# Altium project PE.PrjPcb
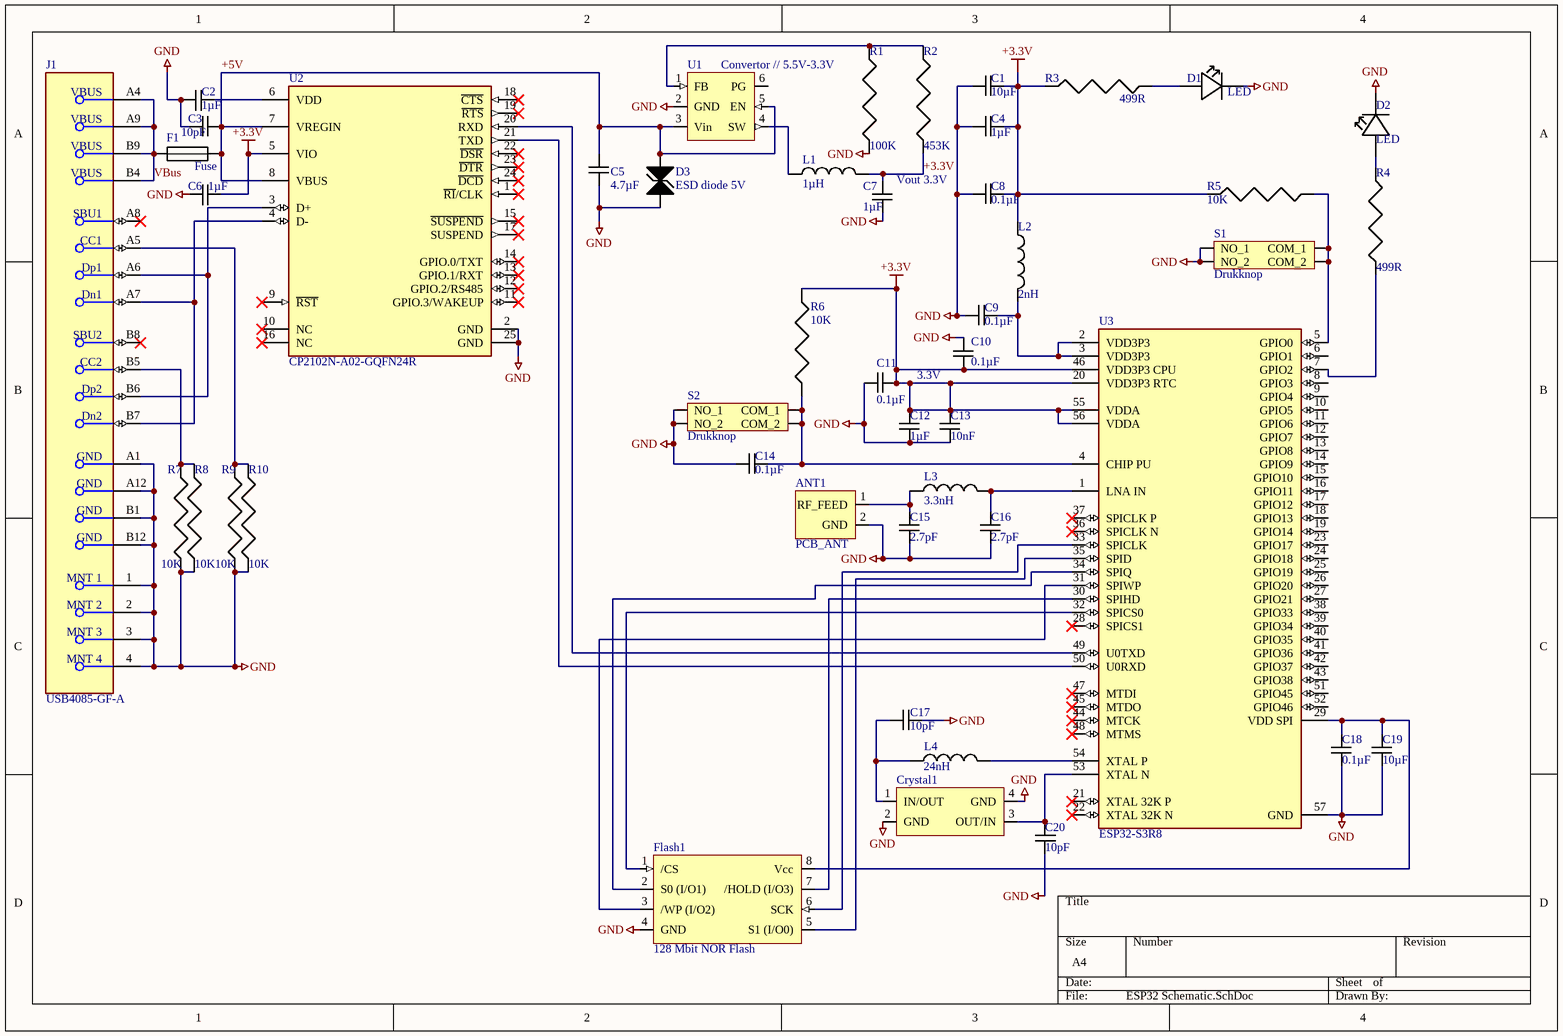
[diagram p0: ESP32 Schematic.SchDoc]
1 sheet, 47 parts. Net scope: global (net labels, ports and power ports of the same name join across sheets).
Board files: PCB-v1.PcbDoc, PCB-v2.PcbDoc, PCB-v3.PcbDoc

## Sheet ESP32 Schematic.SchDoc
size A4; SheetNumber: 1; SheetTotal: 1

### Parts
ANT1  PCB_ANT  [Antenne // RFANT5220110A0T]
C1  10µF  [CAP_General_0603]
C2  1µF  [CAP_General_0603]
C3  10pF  [CAP_General_0603]
C4  1µF  [CAP_General_0603]
C5  4.7µF  [CAP_General_0603]
C6  1µF  [CAP_General_0603]
C7  1µF  [CAP_General_0603]
C8  0.1µF  [CAP_General_0603]
C9  0.1µF  [CAP_General_0603]
C10  0.1µF  [CAP_General_0603]
C11  0.1µF  [CAP_General_0603]
C12  1µF  [CAP_General_0603]
C13  10nF  [CAP_General_0603]
C14  0.1µF  [CAP_General_0603]
C15  2.7pF  [CAP_General_0603]
C16  2.7pF  [CAP_General_0603]
C17  10pF  [CAP_General_0603]
C18  0.1µF  [CAP_General_0603]
C19  10µF  [CAP_General_0603]
C20  10pF  [CAP_General_0603]
Crystal1  Crystal  [Crystal // ECS­400­8­47B2­CKM­TR]  (value not drawn)
D1  LED  [LED // KRDELPS1.22-UIVG-46-H3Q4-XX]
D2  LED  [LED // KRDELPS1.22-UIVG-46-H3Q4-XX]
D3  ESD diode 5V  [ESD diode 5V // SMF5.0A]
F1  Fuse  [Fuse // 0603L050SLYR]
Flash1  128 Mbit NOR Flash  [128 Mbit NOR Flash // AT25QF128A-MHB-T]
J1  USB4085-GF-A  [USB-C connector // USB4085-GF-A]
L1  1µH  [Inductor 1µH // MLP2520H1R0MT0S1]
L2  2nH  [Inductor 2nH // MLG1005S2N0BTD25]
L3  3.3nH  [Inductor 3.3nH // AIMC-0805-3N3]
L4  24nH  [Inductor 24 nH // 36501J24NJTDG]
R1  100K  [RES_100K_0603]
R2  453K  [RES_453K_0603]
R3  499R  [RES_499R_0603]
R4  499R  [RES_499R_0603]
R5  10K  [RES_10K_0603_1]
R6  10K  [RES_10K_0603_1]
R7  10K  [RES_10K_0603_1]
R8  10K  [RES_10K_0603_1]
R9  10K  [RES_10K_0603_1]
R10  10K  [RES_10K_0603_1]
S1  Drukknop  [Tactile Switches // FSM4JSMAATR]
S2  Drukknop  [Tactile Switches // FSM4JSMAATR]
U1  Convertor // 5.5V-3.3V  [CONVERTOR // TLV62569APDRLR]
U2  CP2102N-A02-GQFN24R  [USB Bridge // CP2102N-A02-GQFN24R]
U3  ESP32-S3R8  [FP-ESP32-S3R8]

### Nets
+3.3V: C1.2 C4.2 C6.1 C7.2 C8.2 C10.1 C11.2 C12.2 C13.2 L1.2 L2.1 R2.2 R3.1 R5.1 R6.2 U2.5(VIO) U3.20(VDD3P3_RTC) U3.46(VDD3P3_CPU) U3.55(VDDA) U3.56(VDDA)
GND: ANT1.2(GND) C1.1 C2.2 C3.1 C4.1 C5.1 C6.2 C7.1 C8.1 C9.1 C10.2 C11.1 C12.1 C13.1 C14.1 C15.1 C16.1 C17.2 C18.1 C19.1 C20.2 Crystal1.2(GND) Crystal1.4(GND) D1.2 D2.2 D3.2 Flash1.4(GND) J1.1(MNT_1) J1.2(MNT_2) J1.3(MNT_3) J1.4(MNT_4) J1.A1(GND) J1.A12(GND) J1.B1(GND) J1.B12(GND) R1.1 R7.1 R8.1 R9.1 R10.1 S1.3(NO_1) S1.4(NO_2) S2.3(NO_1) S2.4(NO_2) U1.2(GND) U2.2(GND) U2.25(GND) U3.57(GND)
+5V: C3.2 C5.2 D3.1 F1.2 U1.3(Vin) U1.5(EN) U2.7(VREGIN) U2.8(VBUS)
VBus: F1.1 J1.A4(VBUS) J1.A9(VBUS) J1.B4(VBUS) J1.B9(VBUS)
NetANT1_1: ANT1.1(RF_FEED) C15.2 L3.1
NetC2_1: C2.1 U2.6(VDD)
NetC9_2: C9.2 L2.2 U3.2(VDD3P3) U3.3(VDD3P3)
NetC14_2: C14.2 R6.1 S2.1(COM_1) S2.2(COM_2) U3.4(CHIP_PU)
NetC16_2: C16.2 L3.2 U3.1(LNA_IN)
NetC17_1: C17.1 Crystal1.1(IN/OUT) L4.1
NetC18_2: C18.2 C19.2 Flash1.8(Vcc) U3.29(VDD_SPI)
NetC20_1: C20.1 Crystal1.3(OUT/IN) U3.53(XTAL_N)
NetD1_1: D1.1 R3.2
NetD2_1: D2.1 R4.2
NetFlash1_1: Flash1.1(/CS) U3.32(SPICS0)
NetFlash1_2: Flash1.2(S0_(I/O1)) U3.34(SPIQ)
NetFlash1_3: Flash1.3(/WP_(I/O2)) U3.31(SPIWP)
NetFlash1_5: Flash1.5(S1_(I/O0)) U3.35(SPID)
NetFlash1_6: Flash1.6(SCK) U3.33(SPICLK)
NetFlash1_7: Flash1.7(/HOLD_(I/O3)) U3.30(SPIHD)
NetJ1_A5: J1.A5(CC1) R9.2 R10.2
NetJ1_A6: J1.A6(Dp1) J1.B6(Dp2) U2.3(D+)
NetJ1_A7: J1.A7(Dn1) J1.B7(Dn2) U2.4(D-)
NetJ1_B5: J1.B5(CC2) R7.2 R8.2
NetL1_1: L1.1 U1.4(SW)
NetL4_2: L4.2 U3.54(XTAL_P)
NetR1_2: R1.2 R2.1 U1.1(FB)
NetR4_1: R4.1 U3.7(GPIO2)
NetR5_2: R5.2 S1.1(COM_1) S1.2(COM_2) U3.5(GPIO0)
NetU2_20: U2.20(RXD) U3.49(U0TXD)
NetU2_21: U2.21(TXD) U3.50(U0RXD)

Not connected (* = marked no-connect by the designer): J1 A8(SBU1)* B8(SBU2)*; U1 6(PG); U2 1(~{RI}/CLK)* 9(~{RST})* 10(NC)* 11(GPIO.3/WAKEUP)* 12(GPIO.2/RS485)* 13(GPIO.1/RXT)* 14(GPIO.0/TXT)* 15(~{SUSPEND})* 16(NC)* 17(SUSPEND)* 18(~{CTS})* 19(~{RTS})* 22(~{DSR})* 23(~{DTR})* 24(~{DCD})*; U3 6(GPIO1) 8(GPIO3) 9(GPIO4) 10(GPIO5) 11(GPIO6) 12(GPIO7) 13(GPIO8) 14(GPIO9) 15(GPIO10) 16(GPIO11) 17(GPIO12) 18(GPIO13) 19(GPIO14) 21(XTAL_32K_P)* 22(XTAL_32K_N)* 23(GPIO17) 24(GPIO18) 25(GPIO19) 26(GPIO20) 27(GPIO21) 28(SPICS1)* 36(SPICLK_N)* 37(SPICLK_P)* 38(GPIO33) 39(GPIO34) 40(GPIO35) 41(GPIO36) 42(GPIO37) 43(GPIO38) 44(MTCK)* 45(MTDO)* 47(MTDI)* 48(MTMS)* 51(GPIO45) 52(GPIO46)

### Notes on the sheet
- (near C7) Vout 3.3V
- 3.3V

### Library data of the parts
ANT1 = Antenne // RFANT5220110A0T
C1-C20 = CAP_General_0603: Capacitor SMD 0603 ?pF
Crystal1 = Crystal // ECS­400­8­47B2­CKM­TR
D1 D2 = LED // KRDELPS1.22-UIVG-46-H3Q4-XX
D3 = ESD diode 5V // SMF5.0A
F1 = Fuse // 0603L050SLYR
Flash1 = 128 Mbit NOR Flash // AT25QF128A-MHB-T
J1 = USB-C connector // USB4085-GF-A: CONN RCPT USB2.0 TYPE C 24POS RA; Gender: Receptacle; Number of Positions: 16; USB Standard: USB 2.0; Orientation: Right Angle; Contact Plating: Gold; Contact Material: Copper Alloy
L1 = Inductor 1µH // MLP2520H1R0MT0S1
L2 = Inductor 2nH // MLG1005S2N0BTD25
L3 = Inductor 3.3nH // AIMC-0805-3N3
L4 = Inductor 24 nH // 36501J24NJTDG
R1 = RES_100K_0603: Resistor SMD 0603 100K
R2 = RES_453K_0603: Resistor SMD 0603 453K
R3 R4 = RES_499R_0603: Resistor SMD 0603 499R
R5-R10 = RES_10K_0603_1: Resistor SMD 0603 10K
S1 S2 = Tactile Switches // FSM4JSMAATR
U1 = Convertor // TLV62569APDRLR
U2 = USB Bridge // CP2102N-A02-GQFN24R: IC USB TO UART BRIDGE QFN24; Manufacturer Lifecycle Status: FULL PRODUCTION; NexarPartId: 99772192; Max Junction Temperature (Tj): 105°C; Min Supply Voltage: 1.71V; Max Supply Voltage: 3.6V; Number of Digital IO: 4; Interface: I2C, RS-485, UART, USB; Lifecycle Status: Production; Min Operating Temperature: -40°C; Height: 800µm; Ambient Temperature Range High: 85°C; Schedule B: 8542390000, 8542390000|8542390000|8542390000|8542390000|8542390000; Max Operating Temperature: 85°C
U3 = ESP32-S3: ESP32-S3R8 RF System on a Chip - SoC SMD IC, Dual-Core MCU, Wi-Fi 2.4G BLE 5.0 Combo; NexarPartId: 118292493